# EAGLE design battery_controller (EAGLE 6.4)
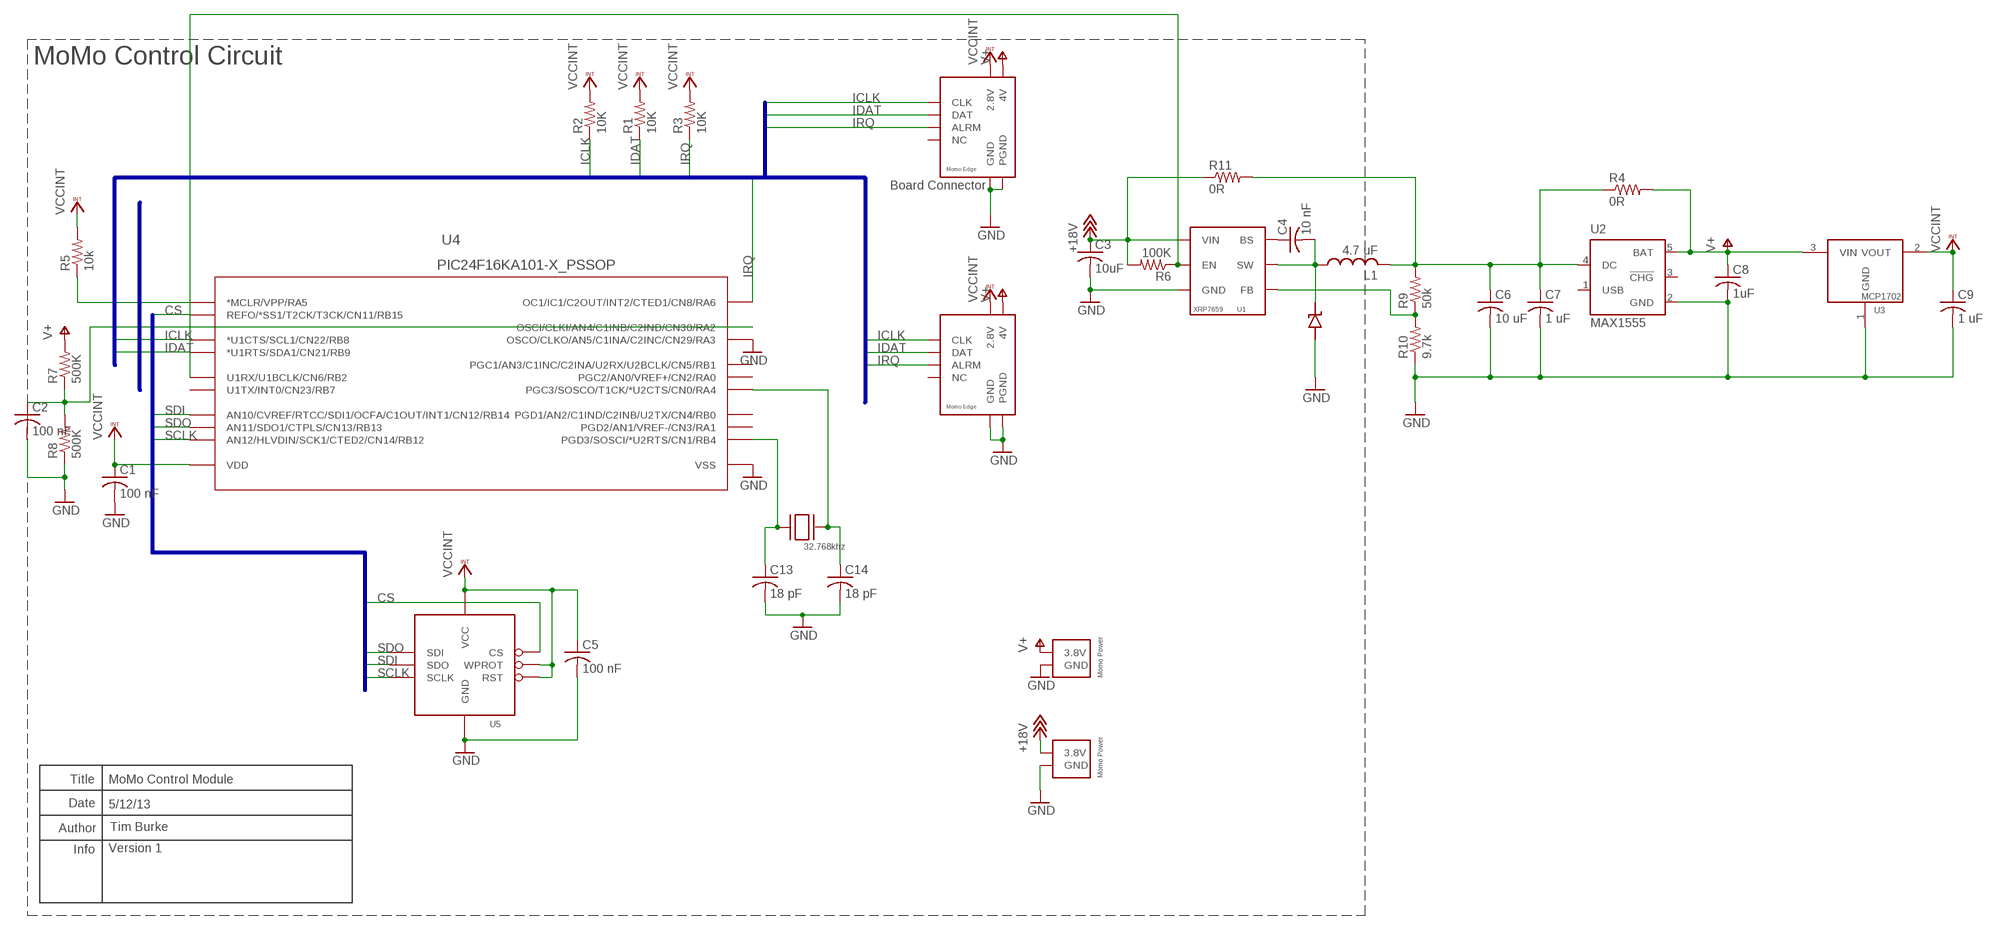
[diagram p0: schematic, sheet 1]

## Parts
C1  100 nF  C-USC0402  [C0402]
C2  100 nF  C-USC0402  [C0402]
C3  10uF  C-USC0805  [C0805]
C4  10 nF  C-USC0402  [C0402]
C5  100 nF  C-USC0402  [C0402]
C6  10 uF  C-USC0805  [C0805]
C7  1 uF  C-USC0402  [C0402]
C8  1uF  C-USC0402  [C0402]
C9  1 uF  C-USC0402  [C0402]
C13  18 pF  C-USC0402K  [C0402K]
C14  18 pF  C-USC0402K  [C0402K]
D1  DIODE_SS2P3SS2P3  [DIODE_SS2P3]
JP1  MOMO-VERT-8M  [1X08]
JP3  MOMO-EDGE-8F  [MOMO-EDGE-8F]
L1  4.7 uF  NR6028-INDUCTOR  [NR6028-INDUCTOR]
R1  10K  R-US_R0603  [R0603]
R2  10K  R-US_R0603  [R0603]
R3  10K  R-US_R0603  [R0603]
R4  0R  R-US_R0603  [R0603]
R5  10k  R-US_R0402  [R0402]
R6  100K  R-US_R0603  [R0603]
R7  500K  R-US_R0603  [R0603]
R8  500K  R-US_R0603  [R0603]
R9  50k  R-US_R0603  [R0603]
R10  9.7k  R-US_R0603  [R0603]
R11  0R  R-US_R0603  [R0603]
U1  XRP7659  [SOT23-6L]
U2  MAX1555  [SOT23-5L]
U3  MCP1702  [SOT23]
U4  PIC24F16KA101-X_PSSOP  [SSOP20]
U5  FLASH8MSOP8  [SOP08]
U$1  MOMO-EDGE-POWER-M  [MOMO-EDGE-SMALL-2M]
U$2  MOMO-EDGE-POWER-M  [MOMO-EDGE-SMALL-2M]
XTAL1  32.768khz  SMD-XTAL  [1206]

## Nets
+18V: C3.1 R6.2 R11.1 U1.5(VIN) U$1.2(3.8V)
CS: U4.18(REFO/*SS1/T2CK/T3CK/CN11/RB15) U5.1(CS)
GND: C1.2 C2.2 C3.2 C5.2 C6.2 C7.2 C8.2 C9.2 C13.2 C14.2 D1.AN JP1.6(GND) JP1.8(PGND) JP3.GND JP3.PGND R8.1 R10.1 U1.2(GND) U2.2(GND) U3.1(GND) U4.8(OSCO/CLKO/AN5/C1INA/C2INC/CN29/RA3) U4.19(VSS) U5.4(GND) U$1.1(GND) U$2.1(GND)
ICLK: JP1.3(CLK) JP3.CLK R2.1 U4.12(*U1CTS/SCL1/CN22/RB8)
IDAT: JP1.4(DAT) JP3.DAT R1.1 U4.13(*U1RTS/SDA1/CN21/RB9)
IRQ: JP1.5(ALRM) JP3.ARLM(ALRM) R3.1 U4.14(OC1/IC1/C2OUT/INT2/CTED1/CN8/RA6)
N$5: C6.1 C7.1 L1.2 R4.1 R9.2 R11.2 U2.4(DC)
N$6: C2.1 R7.1 R8.2 U4.7(OSCI/CLKI/AN4/C1INB/C2IND/CN30/RA2)
N$9: R6.1 U1.4(EN) U4.6(U1RX/U1BCLK/CN6/RB2)
N$10: R9.1 R10.2 U1.3(FB)
N$12: C4.1 U1.1(BS)
N$13: C4.2 D1.CATH L1.1 U1.6(SW)
N$15: R5.1 U4.1(*MCLR/VPP/RA5)
N$24: C14.1 U4.10(PGC3/SOSCO/T1CK/*U2CTS/CN0/RA4) XTAL1.P$2(XTAL2)
N$25: C13.1 U4.9(PGD3/SOSCI/*U2RTS/CN1/RB4) XTAL1.P$1(XTAL1)
SCLK: U4.15(AN12/HLVDIN/SCK1/CTED2/CN14/RB12) U5.6(SCLK)
SDI: U4.17(AN10/CVREF/RTCC/SDI1/OCFA/C1OUT/INT1/CN12/RB14) U5.2(SDO)
SDO: U4.16(AN11/SDO1/CTPLS/CN13/RB13) U5.5(SDI)
V+: C8.1 JP1.7(4V) JP3.V4.(4V) R4.2 R7.2 U2.5(BAT) U3.3(VIN) U$2.2(3.8V)
VCCINT: C1.1 C5.1 C9.1 JP1.1(2.8V) JP3.V28(2.8V) R1.2 R2.2 R3.2 R5.2 U3.2(VOUT) U4.20(VDD) U5.3(WPROT) U5.7(RST) U5.8(VCC)
Unconnected: JP1.2(NC) JP3.NV(NC) U2.1(USB) U2.3(!CHG) U4.2(PGC2/AN0/VREF+/CN2/RA0) U4.3(PGD2/AN1/VREF-/CN3/RA1) U4.4(PGD1/AN2/C1IND/C2INB/U2TX/CN4/RB0) U4.5(PGC1/AN3/C1INC/C2INA/U2RX/U2BCLK/CN5/RB1) U4.11(U1TX/INT0/CN23/RB7)

## Buses
SPI:CS,SDI,SDO,SCLK
COMMS:TX,RX,READY,ON
SENSOR:ICLK,IDAT,IRQ

## Notes on the sheet
- MoMo Control Circuit
- Board Connector
- Title | MoMo Control Module
- Date | 5/12/13
- Author | Tim Burke
- Info | Version 1

## Library data of the parts
C1-C9 C13 C14 = rcl:C-US: CAPACITOR, American symbol
D1 = components:DIODE_SS2P3
JP1 = components:MOMO-VERT-8M
JP3 = components:MOMO-EDGE-8F
L1 = components:NR6028-INDUCTOR
R1-R11 = rcl:R-US_: RESISTOR, American symbol
U1 = components:XRP7659
U2 = maxim:MAX1555: Dual-Input USB/AC Adapter 1-Cell Li+ Battery Chargers Source: http://www.maxim-ic.com .. MAX1551-MAX1555.pdf; MF: MAXIM; MPN: MAX1555EZK+T; OC_FARNELL: 1628222; OC_NEWARK: 59J2761
U3 = components:MCP1702
U4 = components:PIC24F16KA101-X_P
U5 = components:FLASH8M
U$1 U$2 = components:MOMO-EDGE-POWER-M
XTAL1 = components:SMD-XTAL

## Net classes
0 default: width 0.152 mm, drill 0.305 mm, clearance 0.152 mm

## Board
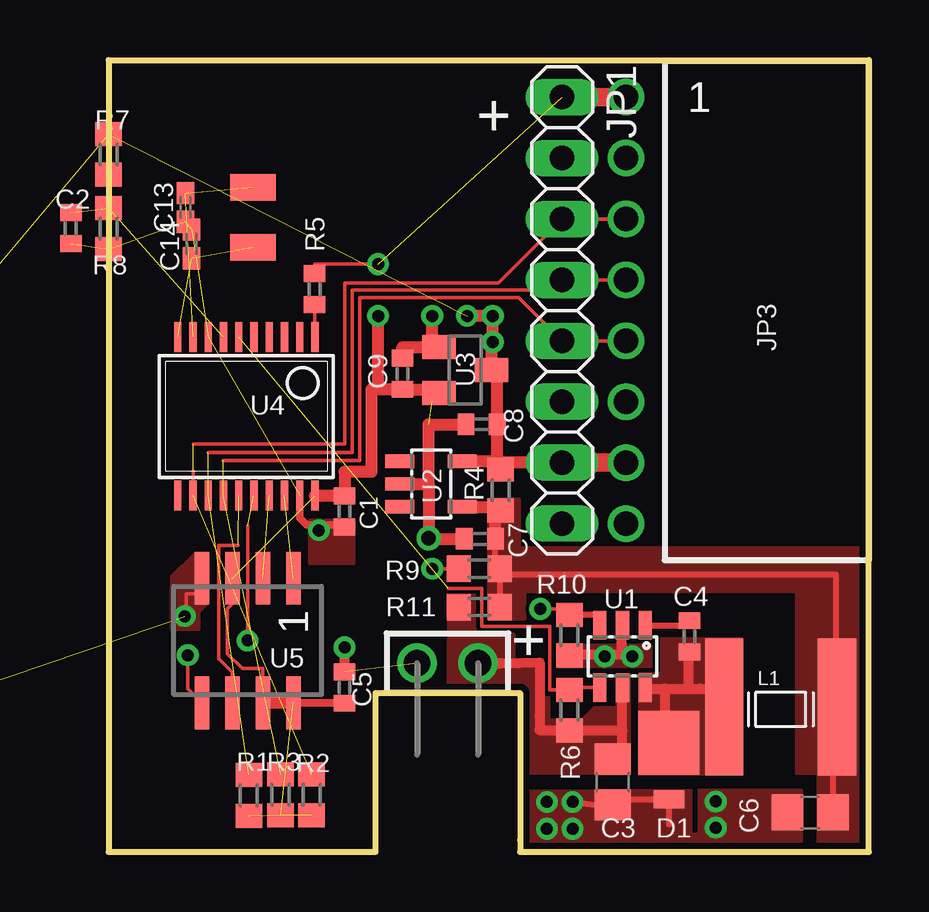
[diagram p1: board, top side]
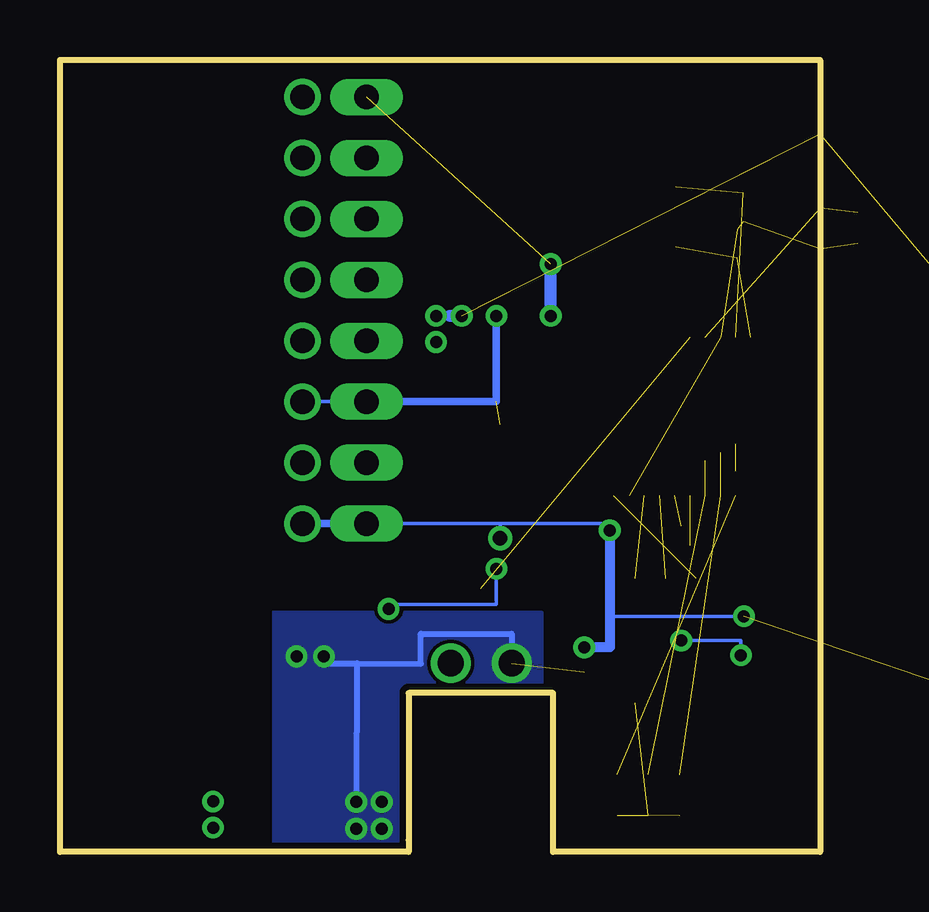
[diagram p2: board, bottom side, seen from below]

Size 31.67 x 33.02 mm. Coordinates in mm from the lower left corner, seen from the top.
Outline: 31.67,0 31.67,33.02 0,33.02 0,0 11.12,0 11.12,6.63 17.14,6.63 17.14,0.51 17.14,0 31.67,0
Copper layers (1*16): Top 0.035mm / dielectric 1.5mm / Bottom 0.035mm
Design rules "default *": minimum track width 6mil, minimum drill 19mil, track to track 6mil, track to pad 6mil, pad to pad 6mil, via to via 6mil, smd to smd 6mil, copper to edge 10mil, drill to drill 8mil, minimum pad ring 10mil, minimum via ring 8mil, stop-mask expansion 4mil, vias tented up to drill 0mil, thermal gap 10mil

### Footprints (pad centres in the part's own frame; a part is rotated, then mirrored left to right if it is on the bottom)
C0402 = smd 0.7 x 0.9: 1 -0.65,0; 2 0.65,0
C0805 = smd 1.3 x 1.5: 1 -0.95,0; 2 0.95,0
C0402K = smd 0.925 x 0.74: 1 -0.6,0; 2 0.6,0
DIODE_SS2P3 = smd 0.762 x 1.27: AN 2.349,0 | smd 2.667 x 2.54: CATH 0,0
1X08 = drill 1.016 long: 1 -8.89,0; 2 -6.35,0; 3 -3.81,0; 4 -1.27,0; 5 1.27,0; 6 3.81,0; 7 6.35,0; 8 8.89,0
MOMO-EDGE-8F = drill 1.016: ARLM 0,0; CLK 0,5.08; DAT 0,2.54; GND 0,-2.54; NV 0,7.62; PGND 0,-7.62; V4. 0,-5.08; V28 0,10.16
NR6028-INDUCTOR = smd 1.6 x 5.7: 1 0,0; 2 4.7,0
R0603 = smd 1 x 1.1: 1 -0.85,0; 2 0.85,0
R0402 = smd 0.7 x 0.9: 1 -0.65,0; 2 0.65,0
SOT23-6L = smd 0.55 x 1.2: 1 -0.95,-1.3; 2 0,-1.3; 3 0.95,-1.3; 4 0.95,1.3; 5 0,1.3; 6 -0.95,1.3
SOT23-5L = smd 0.55 x 1.2: 1 -0.95,-1.3; 2 0,-1.3; 3 0.95,-1.3; 4 0.95,1.3; 5 -0.95,1.3
SOT23 = smd 1 x 1.4: 1 -0.95,-1.1; 2 0.95,-1.1; 3 0,1.1
SSOP20 = smd 0.305 x 1.245: 1 -2.857,-3.302; 2 -2.222,-3.302; 3 -1.587,-3.302; 4 -0.952,-3.302; 5 -0.317,-3.302; 6 0.318,-3.302; 7 0.953,-3.302; 8 1.588,-3.302; 9 2.223,-3.302; 10 2.858,-3.302; 11 2.858,3.302; 12 2.223,3.302; 13 1.588,3.302; 14 0.953,3.302; 15 0.318,3.302; 16 -0.317,3.302; 17 -0.952,3.302; 18 -1.587,3.302; 19 -2.222,3.302; 20 -2.857,3.302
SOP08 = smd 0.6 x 2.2: 1 -1.905,-2.6; 2 -0.635,-2.6; 3 0.635,-2.6; 4 1.905,-2.6; 5 1.905,2.6; 6 0.635,2.6; 7 -0.635,2.6; 8 -1.905,2.6
MOMO-EDGE-SMALL-2M = drill 1.1: 1 1.27,0; 2 -1.27,0
1206 = smd 1.1 x 1.9: P$1 0,0; P$2 2.5,0

### Placement (x,y rotation side)
C1  9.83,14.2 270 top
C2  -1.57,26.01 270 top
C3  21.01,2.92 270 top
C4  24.21,8.99 270 top
C5  9.83,6.86 90 top
C6  29.24,1.65 180 top
C7  15.47,13.06 180 top
C8  15.54,17.83 180 top
C9  12.24,19.94 90 top
C13  3.2,26.87 270 top
C14  3.45,25.35 90 top
D1  23.34,4.55 270 top
JP1  18.9,22.58 270 top
JP3  21.56,21.31 0 top
L1  25.65,6.05 0 top
R1  5.84,2.36 270 top
R2  8.46,2.39 270 top
R3  7.16,2.39 270 top
R4  16.33,15.09 90 top
R5  8.59,23.47 90 top
R6  19.2,5.92 270 top
R7  0,29.08 90 top
R8  0,25.98 90 top
R9  15.44,11.81 0 top
R10  19.2,9.04 90 top
R11  15.44,10.21 0 top
U1  21.41,8.15 180 top
U2  13.44,15.34 270 top
U3  14.86,20.09 270 top
U4  5.74,18.16 180 top
U5  5.79,8.81 180 top
U$1  14.12,7.87 180 top
U$2  -22.71,1.4 0 top  (outside the outline)
XTAL1  6.02,27.71 270 top

### Tracks (layer width: path | path; a pad name or v marks a point on that pad's centre or on a via)
+18V
  Top 0.406: 21.41,5.07 R6.2 19.2,5.08 18.19,5.08 17.96,5.08 17.96,5.66 17.96,7.9 16.33,7.87 | 21.41,5.07 U1.5 | C3.1 21.41,3.87 21.41,5.07 | U$1.2 16.33,7.87 | 16.18,7.87 16.33,7.87
  pour Top (rank 2, no thermals): 14.15,6.83 17.55,6.86 17.55,3.3 21.69,3.3 21.69,7.39 21.18,7.39 21.18,6.02 20.24,6.02 19.71,5.49 18.34,5.49 18.34,6.43 18.11,6.43 18.11,8.03 16.89,8 16.89,9.07 16.66,9.07 16.69,10.77 14.17,10.77
CS  (1 unrouted)
GND  (via drill 0.5, 0.6)  (8 unrouted)
  Top 0.152: v3.17,9.83 3.23,9.83 3.23,10.77 3.89,10.77 U5.4 | C7.2 14.68,13.06 | 13.33,13.06 v13.33,13.08
  Top 0.254: 21.39,8.23 21.82,8.23 v21.82,8.15 | 23.34,1.14 D1.AN 21.01,2.2 C3.2 21.01,1.85 v19.33,2.08
  Top 0.305: U4.19 7.96,13.93 8.25,13.64 8.89,13.64 | 8.89,13.64 9.74,13.64 C1.2 | v8.76,13.41 8.89,13.64
  Top 0.406: C5.2 v9.83,8.53 | R10.1 19.2,8.23 21.39,8.23 21.39,9.45 U1.2
  Top 0.508: C9.2 12.24,21.04 U3.1 13.49,21.31 v13.49,22.35 | U2.2 13.33,15.34 | 13.33,15.34 v13.33,13.08 | 13.33,15.34 13.33,17.83 C8.2 | 13.33,13.06 C7.2
  Bottom 0.152: 8.66,9.88 8.76,9.98 | v3.17,9.83 8.76,9.83 8.76,9.58 | 3.17,10.13 v3.17,9.83 | 13.33,13.69 8.76,13.69 v8.76,13.41 | 3.23,9.83 v3.17,9.83 | JP1.8 13.33,13.69 | 13.33,13.69 v13.33,13.08 | JP1.6 JP3.GND
  Bottom 0.254: v20.68,8.15 20.68,7.87 | 20.68,7.87 16.64,7.85 16.64,9.09 12.85,9.09 U$1.1 | 20.68,7.87 19.3,7.87 v19.33,2.08
  Bottom 0.305: v13.49,22.35 13.49,18.77 JP1.6 | JP1.8 JP3.PGND
  Bottom 0.406: v8.76,13.41 8.76,9.98 8.76,9.58 8.76,8.53 v9.83,8.53
  other vias: 19.33,0.97 25.3,2.11 25.3,1.02 18.26,2.08 18.26,0.97
  pour Top (no thermals): 10.21,13.82 10.21,12.04 8.38,12.04 8.38,13.82
  pour Top (no thermals): 3.61,12.45 2.64,11.48 2.64,9.27 3.76,9.27 3.76,10.01 4.11,10.36 4.11,12.45
  pour Top (no thermals): 17.02,2.54 24.26,2.57 24.26,0.74 24.61,0.74 24.61,2.57 28.85,2.57 28.85,-0.08 16.97,-0.13
  pour Bottom (no thermals): 11.58,0.03 11.61,9.98 22.76,10.01 22.76,0.05
  pour Top (no thermals): 22.58,8.61 22.58,7.75 18.72,7.75 18.72,8.61
ICLK  (2 unrouted)
  Top 0.152: U4.12 3.52,15.88 | 3.52,17.02 9.83,17.02 9.83,23.72 11.81,23.72 16.23,23.72 JP1.3 JP3.CLK
IDAT  (2 unrouted)
  Top 0.152: 4.15,16.66 10.16,16.66 10.16,23.42 12.78,23.42 18.47,23.42 JP1.4 JP3.DAT
IRQ  (2 unrouted)
  Top 0.152: 4.79,16.33 10.46,16.33 10.46,23.11 13.74,23.11 17.09,23.11 JP1.5 JP3.ARLM
N$5
  Top 0.254: C6.1 30.19,6.04 L1.2 30.3,6.04 30.3,11.56 16.29,11.56 | 16.29,11.56 R9.2 16.12,11.81 C7.1 | 16.29,11.56 R11.2
  Top 0.508: C7.1 16.12,14.24 R4.1 16.18,14.39 U2.4
  pour Top (no thermals): 15.85,14.71 15.85,9.73 17.35,9.73 17.35,10.87 28.68,10.87 28.68,3.28 29.57,3.28 29.57,-0.08 31.72,-0.08 31.72,12.67 17.12,12.67 17.12,14.71
N$6  (3 unrouted)
  Top 0.152: C2.1 -1.58,26.83
N$9  (1 unrouted)
  Top 0.152: U1.4 19.2,6.85 R6.1 18.39,6.77 18.39,8.46 18.39,9.32 18.39,9.4 15.54,9.4 15.54,11 14.15,11
N$10  (via drill 0.5)
  Top 0.152: R10.2 19.2,10.13 v17.98,10.13 | v13.49,11.81 13.54,11.81 R9.1
  Top 0.254: U1.3 20.46,9.89 R10.2 19.2,9.95
  Bottom 0.152: v17.98,10.13 17.98,10.31 13.49,10.31 v13.49,11.81
N$12
  Top 0.254: U1.1 24.21,9.45 C4.1
N$13
  Top 0.406: U1.6 22.36,6.81 23.19,6.81 | 23.19,6.81 24.16,6.81 | 24.16,6.81 24.64,6.81 25.65,6.81 L1.1 | C4.2 24.16,8.34 24.16,6.81 | D1.CATH 23.19,4.55 23.19,6.81
  pour Top (no thermals): 22.12,7.42 23.04,7.42 23.04,8.89 26.39,8.89 26.39,3.25 22.12,3.25
N$15
  Top 0.152: 8.6,22.89 R5.1 8.6,22.82 U4.1
  Top 0.305: 8.6,22.89 R5.1
N$24  (2 unrouted)
N$25  (2 unrouted)
SCLK  (1 unrouted)
  Top 0.152: U4.15 | 5.41,12.78 4.6,12.78 4.6,8.05 5.16,7.49 U5.6
SDI  (1 unrouted)
SDO  (via drill 0.5)  (1 unrouted)
  Top 0.152: U4.16 6.04,14.86 | 5.79,13.59 v5.79,8.81 | v3.3,8.2 3.3,6.8 U5.5
  Bottom 0.152: v5.79,8.81 3.3,8.81 v3.3,8.2
V+  (via drill 0.5)  (2 unrouted)
  Top 0.305: U3.3 15.7,20.09
  Top 0.508: R4.2 16.19,15.94 C8.1 16.19,20.09 U3.3 15.96,21.26 v16,21.26 v16,22.35 v14.93,22.35 | JP1.7 16.33,16.23 R4.2 | U2.5 15.98,16.29 R4.2
  Top 0.762: JP1.7 JP3.V4.
  Bottom 0.508: v14.93,22.35 15.42,22.35
VCCINT  (via drill 0.5)  (5 unrouted)
  Top 0.152: U5.3 5.16,10.34 4.95,10.13 4.95,8.26 5.56,7.65 6.43,7.65 U5.7 | R5.2 8.58,24.51 v11.23,24.51
  Top 0.305: 9.83,14.88 C1.1 | U5.8 C5.1
  Top 0.508: U3.2 13.76,19.29 C9.1 11.23,19.29 | 11.23,19.29 v11.23,22.35 | 11.23,19.29 10.95,19.29 10.95,15.85 9.83,15.85 C1.1 U4.20 | U5.8 U5.7
  Top 0.762: JP3.V28 JP1.1
  Bottom 0.508: v11.23,22.35 v11.23,24.51

### Text on the board
tPlace: + | +
Reference: JP4 | XTAL1 | JP5